# EAGLE design PiShutdownButton (EAGLE 8.2.1)
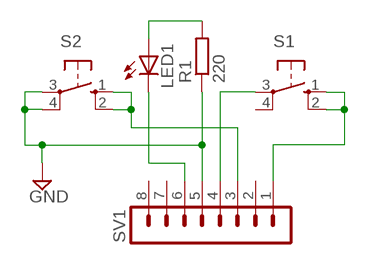
[diagram p0: schematic, sheet 1]

## Parts
LED1  LED3MM  [LED3MM]
R1  220  R-EU_0204/5  [0204/5]
S1  10-XX  [B3F-10XX]
S2  10-XX  [B3F-10XX]
SV1  MA08-1  [MA08-1]

## Nets
GND: R1.1 S2.3(P) S2.4(P1) SV1.5
N$1: S1.3(P) SV1.4
N$2: S1.1(S) S1.2(S1) SV1.1
N$4: S2.1(S) S2.2(S1) SV1.3
N$5: LED1.A R1.2
N$6: LED1.K(C) SV1.6
Unconnected: S1.4(P1) SV1.2 SV1.7 SV1.8

## Library data of the parts
LED1 = adafruit:LED: LED OSRAM: - CHIPLED LG R971, LG N971, LY N971, LG Q971, LY Q971, LO R971, LY R971 LH N974, LH R974 LS Q976, LO Q976, LY Q976 LO Q996 - Hyper CHIPLED LW Q18S LB Q993, LB Q99A, LB R99A - SideLED LS A670, LO A670, LY A670, LG A670, LP A670 LB A673, LV A673, LT A673, LW A673 LH A674 LY A675 LS A676, LA A676, LO A676, LY A676, LW A676 LS A679, LY A679, LG A679 - Hyper Micro SIDELED® LS Y876, LA Y876, LO Y876, LY Y876 LT Y87S - SmartLED LW L88C, LW L88S LB L89C, LB L89S, LG L890 LS L89K, LO L89K, LY L89K LS L896, LA L896, LO L896, LY L896 - TOPLED LS T670, LO T670, LY T670, LG T670, LP T670 LSG T670, LSP T670, LSY T670, LOP T670, LYG T670 LG T671, LOG T671, LSG T671 LB T673, LV T673, LT T673, LW T673 LH T674 LS T676, LA T676, LO T676, LY T676, LB T676, LH T676, LSB T676, LW T676 LB T67C, LV T67C, LT T67C, LS T67K, LO T67K, LY T67K, LW E67C LS E67B, LA E67B, LO E67B, LY E67B, LB E67C, LV E67C, LT E67C LW T67C LS T679, LY T679, LG T679 LS T770, LO T770, LY T770, LG T770, LP T770 LB T773, LV T773, LT T773, LW T773 LH T774 LS E675, LA E675, LY E675, LS T675 LS T776, LA T776, LO T776, LY T776, LB T776 LHGB T686 LT T68C, LB T68C - Hyper Mini TOPLED® LB M676 - Mini TOPLED Santana® LG M470 LS M47K, LO M47K, LY M47K Source: http://www.osram.convergy.de/
R1 = resistor:R-EU_: RESISTOR, European symbol
S1 S2 = switch-omron:10-XX: OMRON SWITCH; MPN: B3F-1000; OC_FARNELL: 176432; OC_NEWARK: 36M3542
SV1 = con-lstb:MA08-1: PIN HEADER; OC_FARNELL: unknown; OC_NEWARK: unknown

## Board
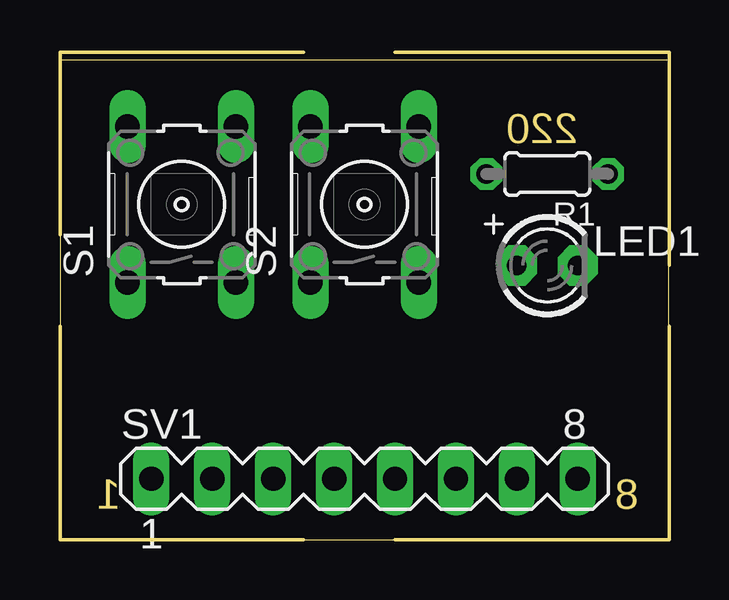
[diagram p1: board, top side]
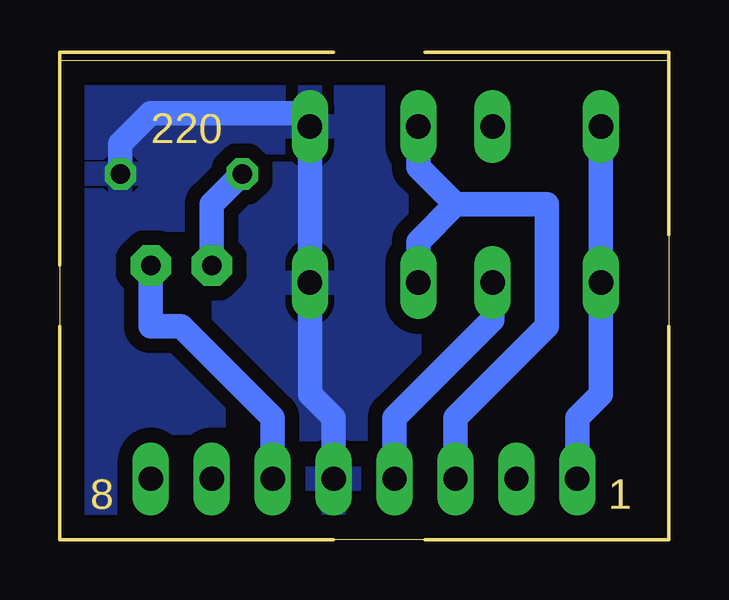
[diagram p2: board, bottom side, seen from below]

Size 25.38 x 19.99 mm. Coordinates in mm from the lower left corner, seen from the top.
Outline: 0,0 25.38,0 25.38,19.99 0,19.99 0,0
Copper layers (1*16): Top 0.035mm / dielectric 1.5mm / Bottom 0.035mm
Design rules "mao *": minimum track width 24mil, minimum drill 0.5mm, track to track 24mil, track to pad 24mil, pad to pad 24mil, via to via 24mil, smd to smd 12mil, copper to edge 40mil, drill to drill 12mil, minimum pad ring 10mil, minimum via ring 8mil, stop-mask expansion 4mil, vias tented up to drill 0mil, thermal gap 10mil
Milling: 8 lines

### Footprints (pad centres in the part's own frame; a part is rotated, then mirrored left to right if it is on the bottom)
LED3MM = drill 0.813 pad 1.676 octagon: A -1.27,0; K 1.27,0
0204/5 = drill 0.813 octagon: 1 -2.54,0; 2 2.54,0
B3F-10XX = drill 1.016 long: 1 -3.251,2.261; 2 3.251,2.261; 3 -3.251,-2.261; 4 3.251,-2.261
MA08-1 = drill 1.016 long: 1 -8.89,0; 2 -6.35,0; 3 -3.81,0; 4 -1.27,0; 5 1.27,0; 6 3.81,0; 7 6.35,0; 8 8.89,0

### Placement (x,y rotation side)
LED1  20.32,11.43 0 top
R1  20.32,15.24 180 top
S1  5.08,13.97 90 top
S2  12.7,13.97 90 top
SV1  12.7,2.54 0 top

### Tracks (layer width: path | path; a pad name or v marks a point on that pad's centre or on a via)
GND
  Bottom 1.016: SV1.5 13.97,5.08 14.96,6.07 S2.3 S2.4 15.52,17.78 21.59,17.78 22.86,16.51 R1.1
  pour Bottom: -3.81,22.86 29.21,22.86 29.21,-2.54 -3.81,-2.54
N$1
  Bottom 1.016: S1.3 7.34,9.17 11.43,5.08 SV1.4
N$2
  Bottom 1.016: SV1.1 3.81,5.08 2.82,6.07 S1.1 S1.2
N$4
  Bottom 1.016: S2.1 10.44,12.42 8.89,13.97 | 8.89,13.97 5.08,13.97 5.08,8.89 8.89,5.08 SV1.3 | S2.2 10.44,15.52 8.89,13.97
N$5
  Bottom 1.016: LED1.A 19.05,13.97 R1.2
N$6
  Bottom 1.016: LED1.K 21.59,8.89 20.32,8.89 16.51,5.08 SV1.6

### Text on the board
Milling: 220 | 1 | 8